# Altium schematic sheet coil_processing.SchDoc
size A
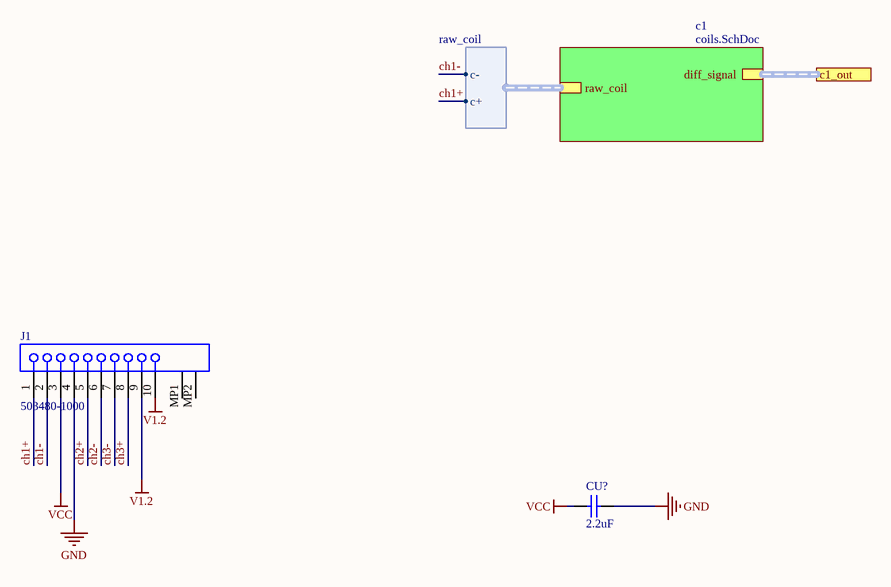
[diagram p0: coil_processing.SchDoc]

## Parts
CU?  value 2.2uF  [0402]  (hidden comment: Cap)
J1  503480-1000  [MOLX-503480-1000]

## Sub-sheets
c1 = coils.SchDoc: raw_coil (harness raw_coil), diff_signal (harness diff_signal)  | C1_val: 2200pF; C2_val: 100pF

## Ports
c1_out (harness diff_signal)

## Harnesses
raw_coil: c-, c+

## Nets
GND: CU?.1 J1.4
V1.2: J1.9 J1.10
VCC: CU?.2 J1.3
ch1+: J1.1 ; sheet c1/raw_coil.c+
ch1-: J1.2 ; sheet c1/raw_coil.c-
ch2+: J1.5
ch2-: J1.6
ch3+: J1.8
ch3-: J1.7

Not connected (* = marked no-connect by the designer): J1 MP1 MP2

## Buses and harness runs
harness port c1_out = sheet c1/diff_signal

## Library data of the parts
CU? = Cap: Ceramic Capacitor (Surface Mount); Manufacturer: Generic Ceramic Chip Cap (TBD); Digi-Key Part Number: *; Manufacturer Part Number: *; Note: *; Rating: *
J1 = CMP-1241-00115-1: 0.5 mm Pitch Easy-On(TM) BackFlip(TM) Type FPC Connector, 1.0 mm Mated Height, Right Angle, SMT, Dual Contact, 10 Circuits, -40 to 85 degC, ELV and RoHS Compliant, Tape and Reel; Manufacturer: Molex; Durability (mating cycles max): 10; Pitch - Mating Interface: 0.50mm; Material - Plating Mating: Gold; Voltage (Max): 50V AC (RMS)/DC; Polarized to PCB: Yes; PCB Locator: No; Current (Max per Contact): 0.5A; Material - Plating Termination: Gold, Tin; Entry Angle: 90degrees Angle; Mated Height: 1.00mm; Material - Metal: Phosphor Bronze; ComponentLink1Description: Manufacturer URL; PartNumber: 503480-1000; Circuits (Loaded): 10; Packing: Tape and Reel; PackageReference: 503480-1000; ComponentLink2URL: http://www.molex.com/webdocs/datasheets/pdf/en-us/5034801000_FFC_FPC_CONNECTORS.pdf; PackageVersion: Rev. F, 09/2012; ComponentLink3Description: Package Specification; ComponentLink3URL: http://www.molex.com/pdm_docs/sd/5034801000_sd.pdf; PackageDescription: 10-Lead FPC Connector, Pitch 0.5 mm; Stackable: No; Mounting Technology: Surface Mount; ComponentLink2Description: Datasheet; PCB Retention: Yes; Number of Rows: 1; Orientation: Right Angle; Contact Position: Dual; RoHS: TRUE; ComponentLink1URL: http://www.molex.com/molex/index.jsp; System: Connector